# EAGLE board SA (EAGLE 9.6.2)
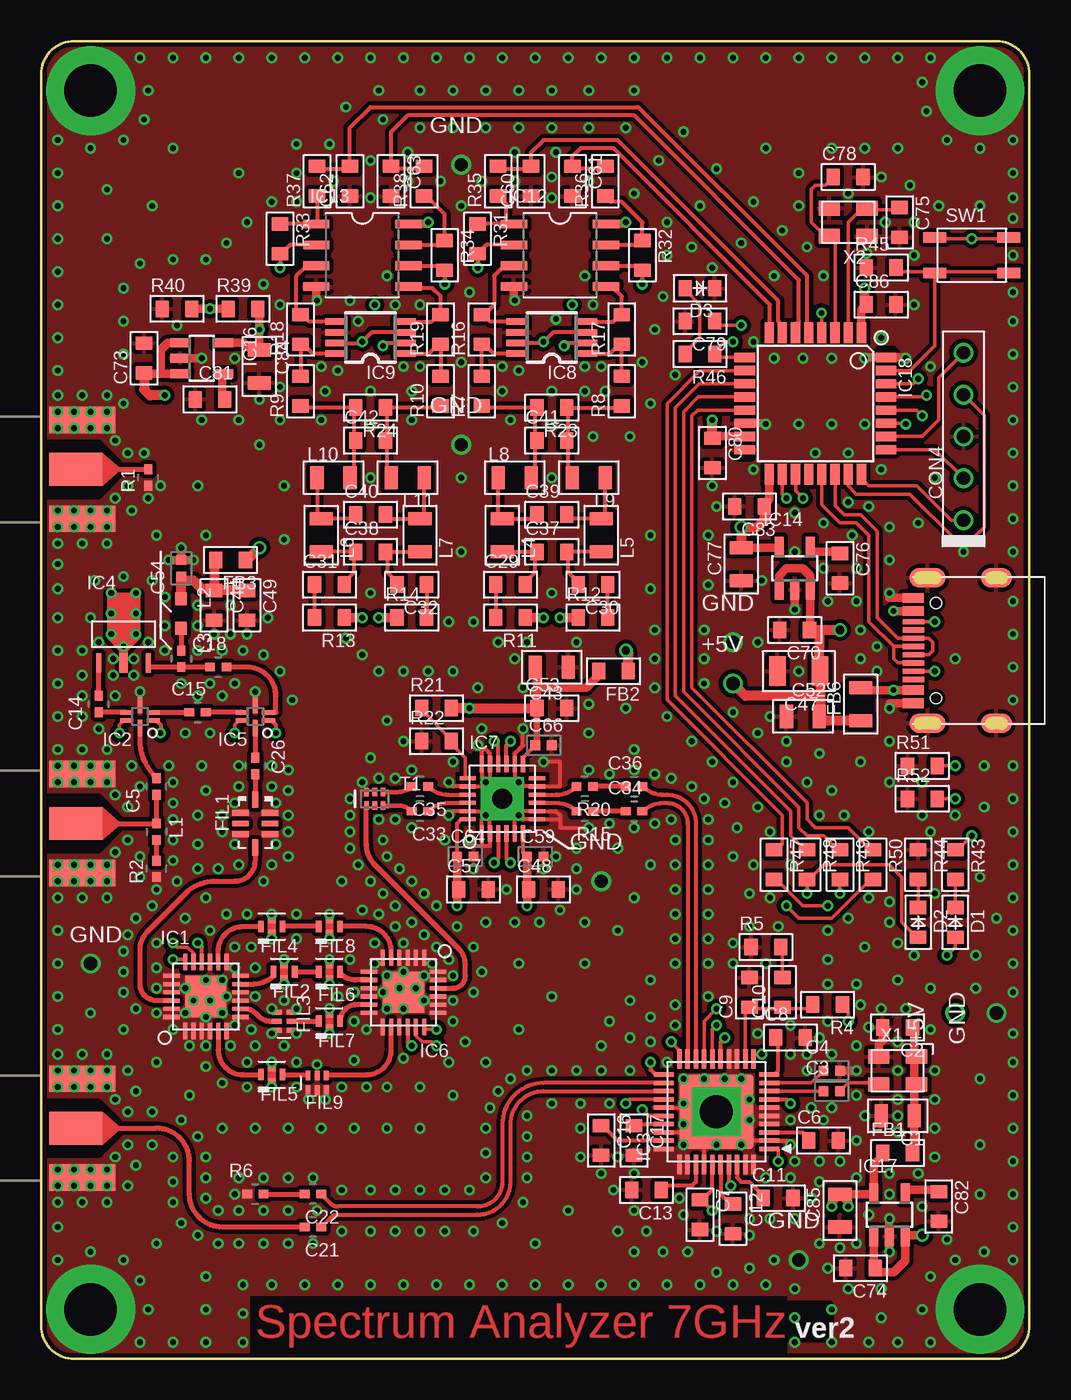
[diagram p2: board, top side]
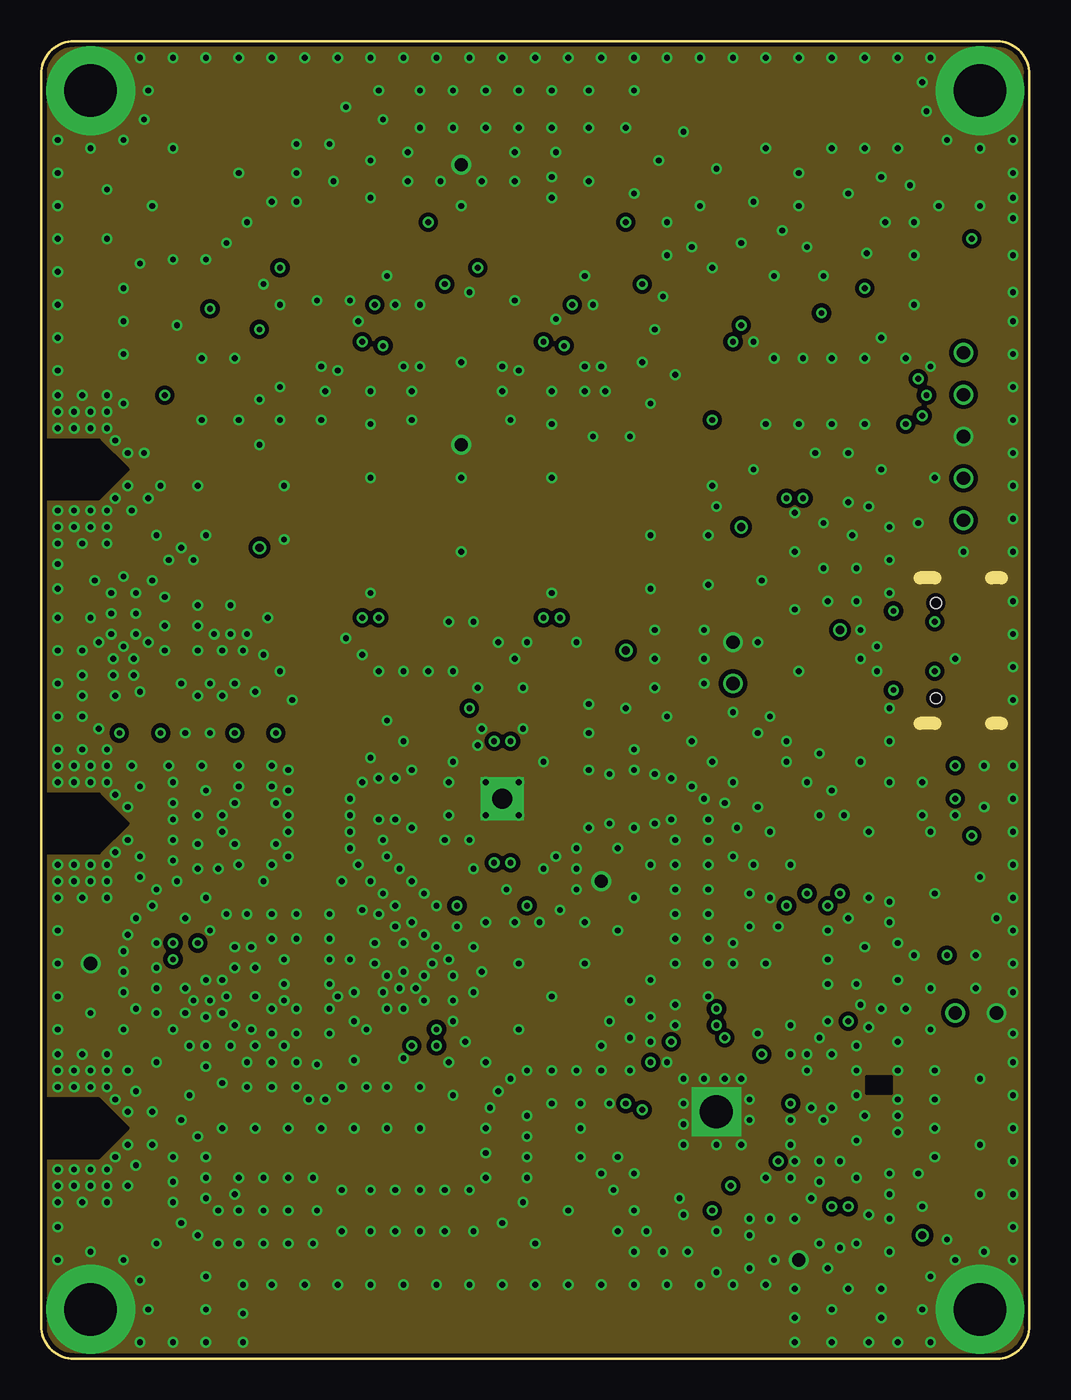
[diagram p3: board, inner layer Route2]
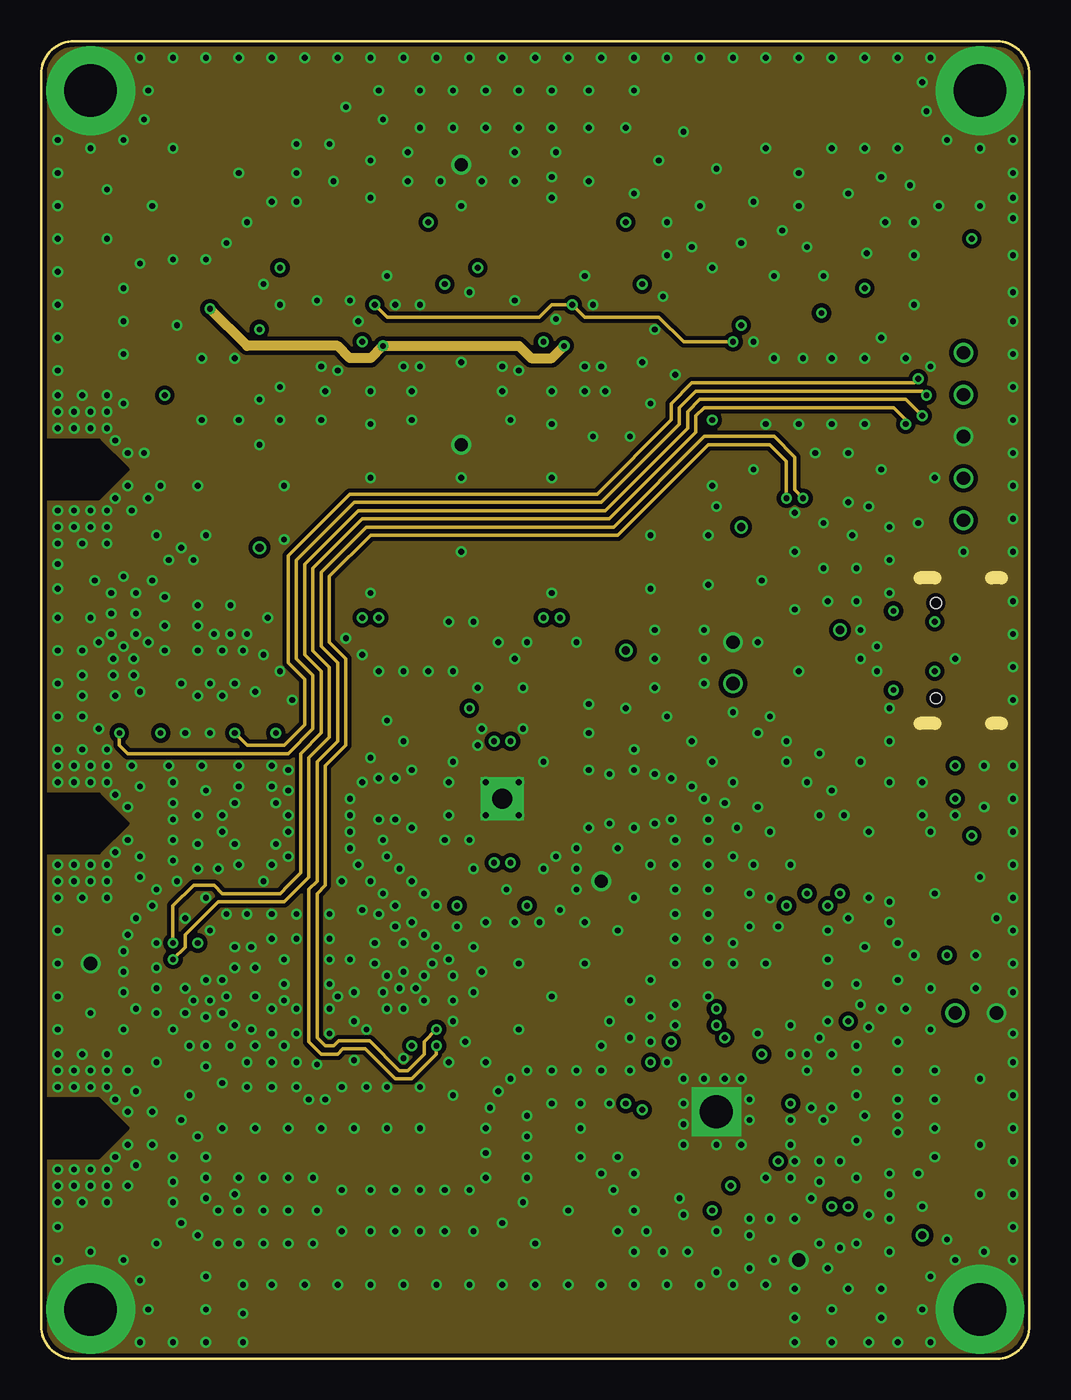
[diagram p4: board, inner layer Route15]
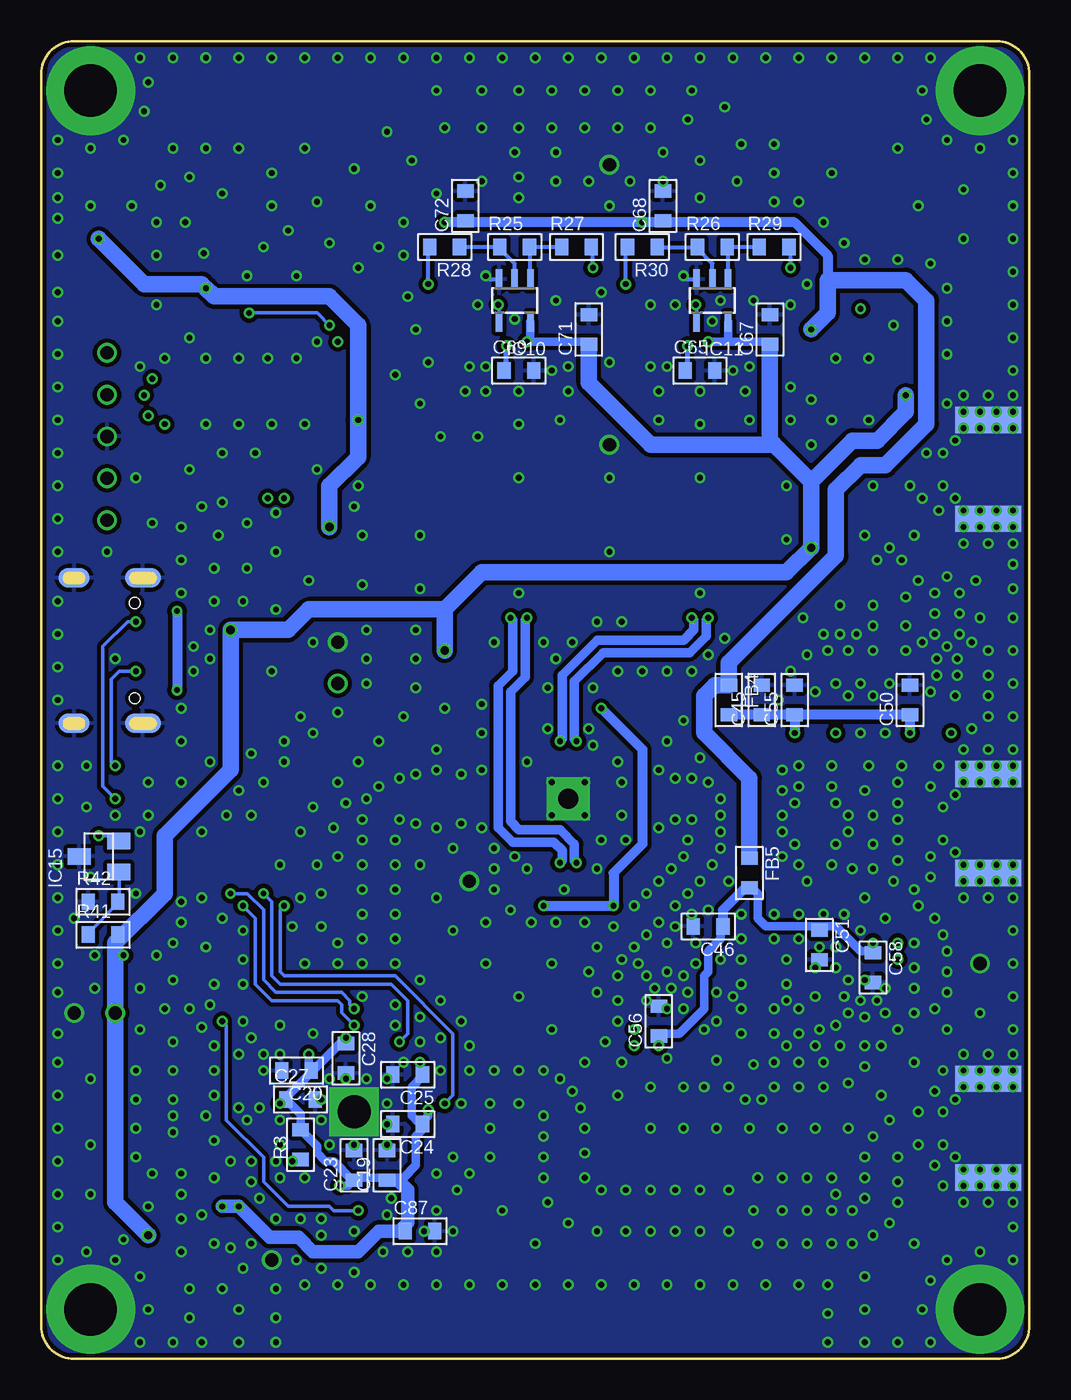
[diagram p5: board, bottom side, seen from below]

Size 60 x 80 mm. Coordinates in mm from the lower left corner, seen from the top.
Outline: 0,78 0,2 arc90 2,0 58,0 arc90 60,2 60,78 arc90 58,80 2,80 arc90 0,78
Copper layers (1*2*15*16): Top 0.035mm / dielectric 0.2mm / Route2 0.0175mm / dielectric 1.065mm / Route15 0.0175mm / dielectric 0.2mm / Bottom 0.035mm
Design rules "JLCPCB_4layer *": minimum track width 6mil, minimum drill 0.3mm, track to track 6mil, track to pad 6mil, pad to pad 6mil, via to via 8mil, smd to smd 0mil, copper to edge 0.2mm, drill to drill 0.4mm, minimum pad ring 8mil, minimum via ring 6mil, stop-mask expansion 2mil, vias tented up to drill 1mm, thermal gap 10mil
tRestrict: 2 lines

## Footprints (pad centres in the part's own frame; a part is rotated, then mirrored left to right if it is on the bottom)
2012 = smd 0.8 x 1.4: 1 -1,0; 2 1,0
1608C = smd 0.8 x 1: 1 -0.9,0; 2 0.9,0
1005 = smd 0.6 x 0.6: 1 -0.5,0; 2 0.5,0
1005RF = smd 0.6 x 0.5: 1 -0.5,0; 2 0.5,0
3216 = smd 1 x 1.8: 1 -1.3,0; 2 1.3,0
SMA-EDGE = smd 1.6 x 4: G1 -3,0; G2 3,0 | smd 1.6 x 4 bottom: G3 -3,0; G4 3,0 | smd 2 x 3.2: SIG 0,0.4
SWD_CON = drill 0.8: 1 -5.08,0; 2 -2.54,0; 3 0,0; 4 2.54,0; 5 5.08,0
5077CR-16-SMC2-BK-TR = smd 0.6 x 1.34: A1,B12:GND -3.2,0.3; A4,B9:VBUS -2.4,0.3; B1,A12:GND 3.2,0.3; B4,A9:VBUS 2.4,0.3 | smd 0.3 x 1.34: A5:CC1 -1.25,0.3; A6:DP1 -0.25,0.3; A7:DN1 0.25,0.3; A8:SBU1 1.25,0.3; B5:CC2 1.75,0.3; B6:DP2 0.75,0.3; B7:DN2 -0.75,0.3; B8:SBU2 -1.75,0.3 | smd 1.2 x 2.2: SHILED1 -4.42,-0.57; SHILED2 4.42,-0.57 | smd 1.2 x 1.9: SHILED3 -4.42,-4.75; SHILED4 4.42,-4.75 | smd 1.2 x 2.2 bottom: SHILED5 -4.42,-0.57; SHILED7 4.42,-0.57 | smd 1.2 x 1.9 bottom: SHILED6 -4.42,-4.75; SHILED8 4.42,-4.75 | hole 0.65: -2.89,-1.07; 2.89,-1.07
D1608 = smd 0.8 x 1: A 0.9,0; K -0.9,0
HOLE_3.2_CON2 = drill 3.2 pad 5.4: T 0,0
1608-FB = smd 0.8 x 1: 1 -0.9,0; 2 0.9,0
2012-R = smd 0.8 x 1.4: 1 -1,0; 2 1,0
RF-FILTER-2012-JOHANSON = smd 0.35 x 1: 1 -0.65,-0.9; 2 0,-0.9; 3 0.65,-0.9; 5 0.65,0.9; 6 0,0.9; 7 -0.65,0.9 | smd 1 x 0.35: 4 1.45,0; 8 -1.45,0
RF-FILTER-1608-TDK = smd 0.35 x 0.7: 1 -0.65,0; 3 0.65,0 | smd 0.45 x 0.4: 2 0,0.4; 4 0,-0.4
RF-FILTER-1608-TDK2 = smd 0.3 x 0.6: 1 -0.55,-0.45; 2 0,-0.45; 3 0.55,-0.45; 4 0.55,0.45; 5 0,0.45; 6 -0.55,0.45
QFN24-QPC6044 = smd 0.25 x 1: 1 -1.25,-2.1; 2 -0.75,-2.1; 3 -0.25,-2.1; 4 0.25,-2.1; 5 0.75,-2.1; 6 1.25,-2.1; 13 1.25,2.1; 14 0.75,2.1; 15 0.25,2.1; 16 -0.25,2.1; 17 -0.75,2.1; 18 -1.25,2.1 | smd 1 x 0.25: 7 2.1,-1.25; 8 2.1,-0.75; 9 2.1,-0.25; 10 2.1,0.25; 11 2.1,0.75; 12 2.1,1.25; 19 -2.1,1.25; 20 -2.1,0.75; 21 -2.1,0.25; 22 -2.1,-0.25; 23 -2.1,-0.75; 24 -2.1,-1.25 | smd 2.5 x 2.5: HT 0,0
SKY13453 = smd 0.8 x 0.28: 1 -0.8,0.25; 2 -0.8,-0.25; 4 0.8,-0.25; 5 0.8,0.25 | smd 0.28 x 1: 3 0,-0.7; 6 0,0.7
QFN40-LMX = smd 0.27 x 1.2: 1 -2.25,-3.2; 2 -1.75,-3.2; 3 -1.25,-3.2; 4 -0.75,-3.2; 5 -0.25,-3.2; 6 0.25,-3.2; 7 0.75,-3.2; 8 1.25,-3.2; 9 1.75,-3.2; 10 2.25,-3.2; 21 2.25,3.2; 22 1.75,3.2; 23 1.25,3.2; 24 0.75,3.2; 25 0.25,3.2; 26 -0.25,3.2; 27 -0.75,3.2; 28 -1.25,3.2; 29 -1.75,3.2; 30 -2.25,3.2 | smd 1.2 x 0.27: 11 3.2,-2.25; 12 3.2,-1.75; 13 3.2,-1.25; 14 3.2,-0.75; 15 3.2,-0.25; 16 3.2,0.25; 17 3.2,0.75; 18 3.2,1.25; 19 3.2,1.75; 20 3.2,2.25; 31 -3.2,2.25; 32 -3.2,1.75; 33 -3.2,1.25; 34 -3.2,0.75; 35 -3.2,0.25; 36 -3.2,-0.25; 37 -3.2,-0.75; 38 -3.2,-1.25; 39 -3.2,-1.75; 40 -3.2,-2.25 | drill 2 pad 3 square: HT 0,0 | smd 4.5 x 4.5: HT2 0,0
SOT89-RF = smd 0.3 x 1.2: 1 -1.5,-1.75; 3 1.5,-1.75 | smd 0.5 x 1.2: 2 0,-1.75
LFCSP24 = smd 0.25 x 1: 1 -1.25,-2.1; 2 -0.75,-2.1; 3 -0.25,-2.1; 4 0.25,-2.1; 5 0.75,-2.1; 6 1.25,-2.1; 13 1.25,2.1; 14 0.75,2.1; 15 0.25,2.1; 16 -0.25,2.1; 17 -0.75,2.1; 18 -1.25,2.1 | smd 1 x 0.25: 7 2.1,-1.25; 8 2.1,-0.75; 9 2.1,-0.25; 10 2.1,0.25; 11 2.1,0.75; 12 2.1,1.25; 19 -2.1,1.25; 20 -2.1,0.75; 21 -2.1,0.25; 22 -2.1,-0.25; 23 -2.1,-0.75; 24 -2.1,-1.25 | drill 1.2 pad 2.6 square: HT 0,0
MSOP8 = smd 0.4 x 1.3: 1 -0.975,-2.1; 2 -0.325,-2.1; 3 0.325,-2.1; 4 0.975,-2.1; 5 0.975,2.1; 6 0.325,2.1; 7 -0.325,2.1; 8 -0.975,2.1
SOT23-5-2 = smd 0.4 x 1.2: 1 -0.95,-1.3; 2 0,-1.3; 3 0.95,-1.3; 4 0.95,1.3; 5 -0.95,1.3
SOP8-3 = smd 0.52 x 1.6: 1 -1.905,-2.8; 2 -0.635,-2.8; 3 0.635,-2.8; 4 1.905,-2.8; 5 1.905,2.8; 6 0.635,2.8; 7 -0.635,2.8; 8 -1.905,2.8
SOT23-5 = smd 0.55 x 1.2: 1 -0.95,-1.3; 2 0,-1.3; 3 0.95,-1.3; 4 0.95,1.3; 5 -0.95,1.3
SC59 = smd 1 x 1.4: 1 -0.95,-1.2; 2 0.95,-1.2; 3 0,1.2
TQFP32-08 = smd 1.27 x 0.559: 1 -4.293,2.8; 2 -4.293,2; 3 -4.293,1.2; 4 -4.293,0.4; 5 -4.293,-0.4; 6 -4.293,-1.2; 7 -4.293,-2; 8 -4.293,-2.8; 17 4.293,-2.8; 18 4.293,-2; 19 4.293,-1.2; 20 4.293,-0.4; 21 4.293,0.4; 22 4.293,1.2; 23 4.293,2; 24 4.293,2.8 | smd 0.559 x 1.27: 9 -2.8,-4.293; 10 -2,-4.293; 11 -1.2,-4.293; 12 -0.4,-4.293; 13 0.4,-4.293; 14 1.2,-4.293; 15 2,-4.293; 16 2.8,-4.293; 25 2.8,4.293; 26 2,4.293; 27 1.2,4.293; 28 0.4,4.293; 29 -0.4,4.293; 30 -1.2,4.293; 31 -2,4.293; 32 -2.8,4.293
1608-L = smd 0.8 x 0.7: 1 -0.9,0; 2 0.9,0
1608 = smd 0.8 x 1: 1 -0.9,0; 2 0.9,0
1608-3 = smd 0.8 x 1: 1 -0.9,0; 2 0.9,0
SKRPACE010 = smd 1.4 x 0.65: 1 -2.24,1.075; 2 2.25,1.075; 3 -2.25,-1.075; 4 2.25,-1.075
X4B40L1 = smd 0.28 x 0.5: 1 -0.5,-0.41; 2 0,-0.41; 3 0.5,-0.41; 4 0.5,0.41; 5 0,0.41; 6 -0.5,0.41
TESTPIN = drill 0.8: 1 0,0
KC3225 = smd 1.3 x 0.9: 1 -1.15,-0.85; 2 1.15,-0.85; 3 1.15,0.85; 4 -1.15,0.85
KC3225-CRYSTAL = smd 1.3 x 0.9: 1 -1.15,-0.85; 2 1.15,-0.85; 3 1.15,0.85; 4 -1.15,0.85

## Placement (x,y rotation side)
C1  10u  [2012]  52,14.75 180 top
C2  0.1u  [1608C]  52,20.12 180 top
C3  1n  [1005]  48,16.25 0 top
C4  1n  [1005]  48,17.5 0 top
C5  22p  [1005RF]  7,34.75 90 top
C6  0.47u  [1608C]  47.5,13.25 0 top
C7  1.5n  [1608C]  40,8.75 270 top
C8  1u  [1608C]  45.5,19.5 0 top
C9  560p  [1608C]  43,22.25 90 top
C10  120n  [1608C]  45,22.25 90 top
C11  10n  [1608C]  44.75,9.75 0 top
C12  10u  [1608C]  42,8.5 270 top
C13  10u  [1608C]  36.75,10.25 180 top
C14  100p  [1005RF]  3.5,39.75 90 top
C15  100p  [1005RF]  9.5,39.25 0 top
C16  10u  [1608C]  34,13.25 270 top
C17  0.1u  [1608C]  36,13.25 270 top
C18  100p  [1005RF]  10.75,42 0 top
C19  1u  [1608C]  39,11.75 90 bottom
C20  0.1u  [1608C]  44.5,17.5 180 bottom
C21  100p  [1005RF]  16.5,8 180 top
C22  100p  [1005RF]  16.5,10 180 top
C23  0.1u  [1608C]  41,11.75 90 bottom
C24  0.1u  [1608C]  37.75,14.25 180 bottom
C25  0.1u  [1608C]  37.75,17.25 180 bottom
C26  100p  [1005RF]  13,36 270 top
C27  0.1u  [1608C]  44.25,15.75 0 bottom
C28  0.1u  [1608C]  41.5,18.25 270 bottom
C29  10u  [1608C]  28.5,47 0 top
C30  10u  [1608C]  33.5,47 180 top
C31  10u  [1608C]  17.5,47 0 top
C32  10u  [1608C]  22.5,47 180 top
C33  100p  [1005RF]  23,33.25 180 top
C34  100p  [1005RF]  36,33.25 0 top
C35  100p  [1005RF]  23,34.75 180 top
C36  100p  [1005RF]  36,34.75 0 top
C37  1000p  [1608C]  31,49 0 top
C38  1000p  [1608C]  20,49 0 top
C39  3300p  [1608C]  31,51.25 0 top
C40  3300p  [1608C]  20,51.25 0 top
C41  1000p  [1608C]  31,55.75 0 top
C42  1000p  [1608C]  20,55.75 0 top
C43  10u  [2012]  31,42 0 top
C44  1u  [1608C]  10.5,45.75 270 top
C45  1u  [1608C]  16.25,40 90 bottom
C46  1u  [1608C]  19.5,26.25 180 bottom
C47  10u  [3216]  46,41.75 180 top
C48  0.1u  [1608C]  30.5,28.5 0 top
C49  10n  [1608C]  12.5,45.75 270 top
C50  0.01u  [1608C]  7.25,40 90 bottom
C51  1u  [1608C]  12.75,25.12 270 bottom
C52  10u  [2012]  46.25,39 180 top
C53  0.1u  [1608C]  31,39.5 0 top
C54  100p  [1005]  8.5,48 90 top
C55  0.01u  [1608C]  14.25,40 90 bottom
C56  0.01u  [1608C]  22.5,20.5 90 bottom
C57  0.1u  [1608C]  26.25,28.5 0 top
C58  0.01u  [1608C]  9.5,23.75 270 bottom
C59  1n  [1005]  30,30.5 0 top
C60  22p  [1608C]  29.75,71.5 90 top
C61  22p  [1608C]  32.25,71.5 270 top
C62  22p  [1608C]  18.75,71.5 90 top
C63  22p  [1608C]  21.25,71.5 270 top
C64  1n  [1005]  25.75,30.5 0 top
C65  0.1u  [1608C]  20,60 0 bottom
C66  1n  [1005]  30.5,37.25 0 top
C67  0.1u  [1608C]  15.75,62.5 90 bottom
C68  0.1u  [1608C]  22.25,70 90 bottom
C69  0.1u  [1608C]  31,60 0 bottom
C70  1u  [1608C]  45.75,44.25 180 top
C71  0.1u  [1608C]  26.75,62.5 90 bottom
C72  0.1u  [1608C]  34.25,70 90 bottom
C73  1u  [1608C]  6.25,60.75 90 top
C74  1u  [1608C]  49.75,5.5 180 top
C75  10p  [1608C]  52.12,69 270 top
C76  0.1u  [1608C]  48.5,48 270 top
C77  10u  [2012]  42.5,48.25 270 top
C78  10p  [1608C]  49,71.75 0 top
C79  0.1u  [1608C]  40,63 180 top
C80  0.1u  [1608C]  40.75,55 270 top
C81  0.1u  [1608C]  10.25,58.25 180 top
C82  0.1u  [1608C]  54.5,9.25 270 top
C83  0.1u  [1608C]  43,51.75 180 top
C84  10u  [2012]  13.25,60.25 270 top
C85  10u  [2012]  48.5,9 270 top
C86  0.1u  [1608C]  51,64 0 top
C87  1u  [1608C]  37,7.75 0 bottom
CON1  DM_L  [SMA-EDGE]  2.5,54 90 top
CON2  RF_IN  [SMA-EDGE]  2.5,32.5 90 top
CON3  PLL_OUT  [SMA-EDGE]  2.5,14 90 top
CON4  SWD_CON  [SWD_CON]  56,56 90 top
CON5  USB-C  [5077CR-16-SMC2-BK-TR]  53.25,43 90 top
D1  PWR  [D1608]  55.5,26.5 270 top
D2  LOCK  [D1608]  53.25,26.5 270 top
D3  LED  [D1608]  40,65 180 top
DR1  HOLE-3.2C  [HOLE_3.2_CON2]  3,3 0 top
DR2  HOLE-3.2C  [HOLE_3.2_CON2]  57,3 0 top
DR3  HOLE-3.2C  [HOLE_3.2_CON2]  3,77 0 top
DR4  HOLE-3.2C  [HOLE_3.2_CON2]  57,77 0 top
FB1  FB  [1608-FB]  52,12.5 0 top
FB2  FB  [1608-FB]  34.75,41.75 180 top
FB3  FB  [1608-FB]  11.5,48.5 180 top
FB4  FB  [1608-FB]  18.25,40 270 bottom
FB5  FB  [1608-FB]  17,29.5 270 bottom
FB6  FB  [2012-R]  49.75,39.75 270 top
FIL1  5515LP15A0730001E  [RF-FILTER-2012-JOHANSON]  13,32.5 270 top
FIL2  DEA165150HT-8025C2  [RF-FILTER-1608-TDK]  14.75,23.5 0 top
FIL3  DEA163500LT-5106C1  [RF-FILTER-1608-TDK2]  14.75,20.5 90 top
FIL4  DEA162025LT-5046C1  [RF-FILTER-1608-TDK]  14,26.25 0 top
FIL5  DEA160960LT-5059A1  [RF-FILTER-1608-TDK]  14,17.25 0 top
FIL6  DEA165150HT-8025C2  [RF-FILTER-1608-TDK]  17.5,23.5 0 top
FIL7  DEA162400HT-8053A1  [RF-FILTER-1608-TDK]  17.5,20.5 0 top
FIL8  DEA162025LT-5046C1  [RF-FILTER-1608-TDK]  17.5,26.25 0 top
FIL9  DEA160787LT-5032A1  [RF-FILTER-1608-TDK2]  16.75,16.75 0 top
IC1  QPC6044  [QFN24-QPC6044]  10,22 0 top
IC2  SKY13453  [SKY13453]  6,39 180 top
IC3  LMX2572  [QFN40-LMX]  41,15 90 top
IC4  SKY65017  [SOT89-RF]  5,44 0 top
IC5  SKY13453  [SKY13453]  13,39 180 top
IC6  QPC6044  [QFN24-QPC6044]  22,22.25 180 top
IC7  ADL5380  [LFCSP24]  28,34 0 top
IC8  MCP6D11  [MSOP8]  31,62 90 top
IC9  MCP6D11  [MSOP8]  20,62 90 top
IC10  SN74LVC1G66  [SOT23-5-2]  31.25,64.25 180 bottom
IC11  SN74LVC1G66  [SOT23-5-2]  19.25,64.25 180 bottom
IC12  TLV3542  [SOP8-3]  31.5,67 270 top
IC13  TLV3542  [SOP8-3]  19.5,67 270 top
IC14  TAR5SB33  [SOT23-5]  45.75,48 0 top
IC15  TLV431  [SC59]  56.5,30.5 90 bottom
IC16  TAR5SB33  [SOT23-5]  9.75,60.75 270 top
IC17  TAR5SB33  [SOT23-5]  51.5,8.75 0 top
IC18  STM32G431K  [TQFP32-08]  47,58 270 top
L1  47nH  [1005RF]  7,32 270 top
L2  100nH  [1608-L]  8.5,45.25 270 top
L3  33nH  [1005RF]  8.5,42.5 270 top
L4  10uH  [2012-R]  28,50 90 top
L5  10uH  [2012-R]  34,50 90 top
L6  10uH  [2012-R]  17,50 90 top
L7  10uH  [2012-R]  23,50 90 top
L8  10uH  [2012-R]  28.75,53.5 0 top
L9  10uH  [2012-R]  33.25,53.5 180 top
L10  10uH  [2012-R]  17.75,53.5 0 top
L11  10uH  [2012-R]  22.25,53.5 180 top
R1  50  [1005RF]  6.5,53.5 90 top
R2  50  [1005RF]  7,29.75 90 top
R3  1k  [1608]  44.25,13 90 bottom
R4  120  [1608]  47.75,21.5 180 top
R5  330  [1608]  44,25 0 top
R6  50  [1005RF]  13,10 0 top
R7  360  [1608]  26.75,58.75 90 top
R8  360  [1608]  35.25,58.75 90 top
R9  360  [1608]  15.75,58.75 90 top
R10  360  [1608]  24.25,58.75 90 top
R11  25  [1608]  28.5,45 180 top
R12  25  [1608]  33.5,45 0 top
R13  25  [1608]  17.5,45 180 top
R14  25  [1608]  22.5,45 0 top
R15  25  [1005RF]  33,33.25 180 top
R16  10k  [1608]  26.75,62.5 90 top
R17  10k  [1608-3]  35.25,62.5 90 top
R18  10k  [1608]  15.75,62.5 90 top
R19  10k  [1608-3]  24.25,62.5 90 top
R20  25  [1005RF]  33,34.75 180 top
R21  DNP  [1608]  24,39.5 0 top
R22  DNP  [1608]  24,37.5 0 top
R23  120  [1608]  31,57.75 180 top
R24  120  [1608]  20,57.75 180 top
R25  1k  [1608]  31.25,67.5 0 bottom
R26  1k  [1608]  19.25,67.5 0 bottom
R27  47  [1608-3]  27.5,67.5 0 bottom
R28  47  [1608-3]  35.5,67.5 180 bottom
R29  47  [1608-3]  15.5,67.5 0 bottom
R30  47  [1608-3]  23.5,67.5 180 bottom
R31  1k  [1608-3]  26.5,68 270 top
R32  1k  [1608-3]  36.5,67 270 top
R33  1k  [1608-3]  14.5,68 270 top
R34  1k  [1608-3]  24.5,67 270 top
R35  39  [1608]  27.75,71.5 90 top
R36  39  [1608]  34.25,71.5 90 top
R37  39  [1608]  16.75,71.5 90 top
R38  39  [1608]  23.25,71.5 90 top
R39  5.1k  [1608]  12.25,63.75 0 top
R40  5.1k  [1608]  8.25,63.75 0 top
R41  10k  [1608]  56.25,25.75 0 bottom
R42  3.6k  [1608]  56.25,27.75 0 bottom
R43  1k  [1608]  55.5,30 270 top
R44  1k  [1608]  53.25,30 270 top
R45  10k  [1608]  51,66.25 0 top
R46  1k  [1608]  40,61 180 top
R47  39  [1608]  44.5,30 270 top
R48  39  [1608]  46.5,30 270 top
R49  39  [1608]  48.5,30 270 top
R50  39  [1608]  50.5,30 270 top
R51  5.1k  [1608]  53.5,36 0 top
R52  5.1k  [1608]  53.5,34 0 top
SW1  BOOT0  [SKRPACE010]  56.5,67 0 top
T1  X4B40L1  [X4B40L1]  20.25,34 0 top
TP1  +5V  [TESTPIN]  42,41 0 top
TP2  GND  [TESTPIN]  42,43.5 0 top
TP3  GND  [TESTPIN]  58,21 90 top
TP4  +5V  [TESTPIN]  55.5,21 90 top
TP5  GND  [TESTPIN]  34,29 0 top
TP6  GND  [TESTPIN]  25.5,72.5 0 top
TP7  GND  [TESTPIN]  25.5,55.5 0 top
TP8  GND  [TESTPIN]  46,6 0 top
TP9  GND  [TESTPIN]  3,24 0 top
X1  48MHz  [KC3225]  52,17.5 180 top
X2  12MHz  [KC3225-CRYSTAL]  49,69 0 top

## Tracks (layer width: path | path; a pad name or v marks a point on that pad's centre or on a via)
+3V3  (via drill 0.35)
  Top 0.508: IC12.8 35.41,68.91 v35.5,69 | IC13.8 23.41,68.91 v23.5,69 | R39.2 13.25,63.65 v13.25,62.5 C84.1 12.75,61.25 12.3,61.7 IC16.5
  Bottom 0.61: 22.5,69 14.25,69 12.25,67 12.25,65.5 | 22.5,69 v23.5,69 34.25,69 | 34.25,69 v35.5,69 | C72.1 34.25,69 | C68.1 22.35,69 22.5,69 | FB5.1 17,30.75
  Bottom 1.016: 17,30.75 17,35.25 19.75,38 19.75,40.25 19.1,40.9 FB4.1 18.25,42.25 11.75,48.75 11.75,52.75 10.25,54.25 8.75,54.25 6.25,56.75 6.25,64.25 7.5,65.5 12.25,65.5 12.25,65 12.25,63.5 v13.25,62.5
+3V3D  (via drill 0.35, 0.5)
  Top 0.203: SW1.1 54.34,68 v56.5,68 58.67,68 SW1.2
  Top 0.508: IC18.15 40.85,56 C80.1 | IC18.17 44.2,52.2 43.9,51.9 C83.1 | IC18.1 49.8,63.7 C86.1 | IC14.5 44.75,49.25 C77.1
  Top 0.61: C80.1 v40.75,57 | C86.1 50,64.1 v50,65 | C77.1 v42.5,50.5 43.5,50.5 43.9,50.9 C83.1
  Bottom 1.016: v42.5,50.5 42.5,53 40.75,54.75 v40.75,57 40.75,62.75 42.5,64.5 49.5,64.5 v50,65 50.25,65.25 53.75,65.25 v56.5,68
+5V  (via drill 0.35, 0.5)
  Top 0.203: D1.A 55.5,25 v55,24.5
  Top 0.254: IC9.3 20.07,62.33 v19.5,61.75 19.43,61.67 IC9.7 | IC8.3 31.07,62.33 v30.5,61.75 30.5,61.67 IC8.7
  Top 0.508: IC14.1 44.8,47.55 45.25,48 46.25,48 46.7,47.55 IC14.3 46.7,44.3 C70.1 | IC16.3 7.25,59.8 | 7.25,59.8 6.3,59.8 C73.1 | IC16.1 7.7,61.7 7.25,61.25 7.25,59.8 | v53.5,7.5 52.5,7.5 IC17.3 52.45,5.95 51.75,5.25 50.9,5.25 C74.1 50.55,5.6 IC17.1
  Top 0.61: 47.3,40.25 C47.1 47.25,41.8 47.25,43 47.25,44.25 C70.1 v48.5,44.25 | 47.3,40.25 47.3,39 C52.1 47.5,38.75 FB6.2 | v13.25,49.25 12.5,48.5 FB3.1 | C73.1 6.25,58.85 6.6,58.5 v7.5,58.5 | TP1.1 42.75,40.25 47.3,40.25 | FB2.1 35.65,42.75 35.65,42.85 v35.5,43
  Bottom 0.203: R41.2 D1.A 55.5,25.25
  Bottom 0.508: IC10.5 30.3,61.75 v30.5,61.75 26.9,61.75 C71.1 26.75,61.25 | v19.5,61.75 18.25,61.75 | 18.25,61.75 15.9,61.75 C67.1 15.75,61.25 | IC11.5 18.3,61.8 18.25,61.75
  Bottom 0.61: v55,24.5 55.5,24.5
  Bottom 1.016: v35.5,43 35.5,45.5 | 35.5,45.5 33.25,47.75 14.75,47.75 v13.25,49.25 13.25,53.25 | 13.25,53.25 10.75,55.75 9.25,55.75 7.5,57.5 v7.5,58.5 | 35.5,45.5 43.75,45.5 45,44.25 v48.5,44.25 48.5,35.75 52.5,31.75 52.5,28.25 55.5,25.25 55.5,24.5 TP4.1 55.5,9.5 v53.5,7.5 | 13.25,53.25 15.25,55.25 15.5,55.5 | 15.5,55.5 15.75,55.75 15.75,61.25 | 15.5,55.5 23,55.5 26.75,59.25 26.75,61.25
ADC_IN
  Top 0.254: R35.2 27.9,72.25 29.6,72.25 C60.2 29.75,73.25 30.5,74 35,74 44.75,64.25 44.75,63 45,62.75 IC18.7
ADC_IP
  Top 0.254: R36.2 34.1,72.25 32.4,72.25 C61.1 32.25,73 32.75,73.5 34.75,73.5 44.25,64 44.25,62.34 IC18.8
ADC_QN
  Top 0.254: R37.2 16.9,72.25 18.6,72.25 C62.2 18.75,74.75 20,76 36.25,76 46.5,65.75 46.5,62.39 IC18.5
ADC_QP
  Top 0.254: R38.2 23.1,72.25 21.4,72.25 C63.1 21.25,74.5 22.25,75.5 36,75.5 46,65.5 46,63 45.8,62.8 IC18.6
AMP_IN
  Top 0.254: 32,53.75 L9.2 32,53.75 | R8.1 35.15,57.75 R23.1 32,57.65 32,55.85 C41.2 32,55.65 32,53.75
AMP_IP
  Top 0.254: 30,53.75 L8.2 30,53.75 | R7.1 26.85,57.75 R23.2 30,57.65 30,55.85 C41.1 30,55.65 30,53.75
AMP_QN
  Top 0.254: L11.2 21,53.75 21,55.65 C42.2 21,55.85 21,57.65 R24.1 24.15,57.75 R10.1
AMP_QP
  Top 0.254: L10.2 19,53.75 19,55.65 C42.1 19,55.85 19,57.65 R24.2 15.85,57.75 R9.1
DUMMY_LOAD
  Top 0.305: CON1.SIG R1.2
FIL_SW1  (via drill 0.35)
  Top 0.203: IC18.28 53.15,57.6 v53.5,57.25 | IC1.17 9.25,24.62 8.88,25 8.25,25 v8,25.25
  Route15 0.203: v53.5,57.25 52.5,58.25 40,58.25 39.25,57.5 39.25,56.5 34.25,51.5 19.25,51.5 16,48.25 16,42.75 17,41.75 17,38 15.75,36.75 15.75,29.5 15,28.75 14.5,28.25 11,28.25 10.5,28.75 9.25,28.75 8,27.5 v8,25.25
FIL_SW2  (via drill 0.35)
  Top 0.203: IC18.27 52.45,56.8 v52.5,56.75 | IC1.18 8.75,24.25 v8,24.25
  Route15 0.203: v52.5,56.75 52.5,57 51.75,57.75 40.25,57.75 39.75,57.25 39.75,56.25 34.5,51 19.5,51 16.5,48 16.5,43 17.5,42 17.5,37.75 16.25,36.5 16.25,29.25 14.75,27.75 10.75,27.75 8.75,25.75 8.75,25 v8,24.25
FIL_SW3  (via drill 0.35)
  Top 0.203: v46.25,52.25 45.8,52.7 IC18.19 | IC6.17 22.75,19.62 23.12,19.25 23.75,19.25 v24,19
  Route15 0.203: v46.25,52.25 45.75,52.75 45.75,54.75 44.5,56 40.25,56 34.75,50.5 19.75,50.5 17,47.75 17,43.25 18,42.25 18,37.5 16.75,36.25 16.75,29 16.25,28.5 16.25,19.25 17,18.5 18,18.5 18.31,18.81 19.69,18.81 21.5,17 22.5,17 24,18.5 v24,19
FIL_SW4  (via drill 0.35)
  Top 0.203: v45.25,52.25 45,52.5 IC18.18 | IC6.18 23.25,20 v24,20
  Route15 0.203: v45.25,52.25 45.25,54.5 44.25,55.5 40.5,55.5 35,50 20,50 17.5,47.5 17.5,43.5 18.5,42.5 18.5,37.25 17.25,36 17.25,28.75 16.75,28.25 16.75,19.5 17.25,19 17.75,19 18.06,19.31 19.94,19.31 21.75,17.5 22.25,17.5 23.25,18.5 23.25,19.25 v24,20
FILTER_IN
  Top 0.305: C26.2 FIL1.8
FILTER_OUT
  Top 0.305: T1.1 19.75,31.25 arc45 20.28,29.97 25.36,24.89 arc-45 25.75,23.95 25.75,23.25 arc-90 25,22.5 IC6.22
GND  (via drill 0.35)
  Top 0.254: v24.75,35 25,34.75 IC7.20 26.75,34.75 v27,35 | 26.75,37 26.75,36.75 IC7.18 26.75,35.25 v27,35 | 26.75,37 v26.5,37.25 | 26.75,37 27,37 27.25,36.75 IC7.17 27.25,35.25 v27,35 | v29.25,38.25 29.25,37.25 28.75,36.75 IC7.14 28.75,35.25 v29,35 29.25,34.75 IC7.11 31.5,34.75 31.5,36.25 v30.5,36.25 | v24.75,33 25,33.25 IC7.23 26.75,33.25 v27,33 | 26.75,31.12 27.25,31.12 IC7.2 27.25,32.75 v27,33 | 26.75,31.12 25.75,31.12 25.75,31.25 v26,31.5 | 26.75,31.12 26.75,31.25 IC7.1 26.75,32.75 v27,33 | 31.5,32.75 31.5,33 31.25,33.25 IC7.8 29.25,33.25 v29,33 | 31.5,32.75 31.5,32.25 v33.25,32.25 | 31.5,32.75 IC7.7 29.25,32.75 v29,33 | IC7.5 28.75,32.75 v29,33 | IC3.25 39,15.25 v39,15.5 | IC3.28 39,13.75 39,13.8 v39,14.25 | IC3.34 40.25,13 v41,13 | v45.5,13 45.25,13.25 IC3.2 42.75,13.25 v42.5,13
  Top 0.508: IC14.2 v45.75,45.5 | IC16.2 v9.75,60.75 | v51.5,6.5 IC17.2 v51.5,8.5 | v16.75,64.25 16.7,64.3 IC13.4 | v28.75,64.25 28.7,64.3 IC12.4 | v52.5,60.75 52.45,60.8 IC18.32 50.05,60.8 v50,60.75 | IC18.14 43.95,56.8 v44,56.75 | C54.2 v7.75,48.5 | C54.2 v8.5,49.25 | C54.2 v9.25,48.5 | CON5.A1,B12:GND 51.55,39.8 51.5,39.75 v51.5,39.5 | CON5.B1,A12:GND 51.5,46.2 v51.5,46.5 | C4.2 v49.5,17.5 | C2.2 51.1,19.35 50.85,19.1 X1.2
  Bottom 0.254: v21,65.75 20.8,65.55 IC11.3 | v33,65.75 32.8,65.55 IC10.3
  other vias: 43.75,47.25 47.75,46 44.5,65.75 40,70 31,74.75 26.75,38.25 24,27.5 21.5,27.5 21,30.5 18.75,31 49.25,50 45.75,51.38 45.75,49 51.5,50.5 55.5,42.5 59,46 59,44 59,42 51.5,37.5 55.5,33 45.25,37.5 40.25,41 51.5,48.5 37.25,44.25 39.5,37.5 44.25,32 51,54 43.25,54 51,62 43.25,61.75 50,56.75 47.5,65.75 45,68.5 41,72.25 35.5,74.75 36,77 31,77 27,74.75 27,77 23,77 23,74.75 18.5,76 20,72.75 25.5,70 40.75,66.25 38,69 15.5,70.25 31,71.75 31,70.5 20,70.5 5,63 12,57 5.75,44 5.75,45.25 4.25,45.25 4.25,44 3.25,47.25 5,47.5 6.75,47.25 8,30.25 1,35 3,35 4,35 4,37 2.5,37 1,37 1,30 2,30 4,30 4,28 2.5,28 1,28 1,16.5 2,16.5 4,16.5 4,18.5 2.5,18.5 1,18.5 1,11.5 3,11.5 4,11.5 4,9.5 2.5,9.5 1,9.5 6,40.5 9.5,43 11.5,45.75 11.75,33.75 11.75,31.25 14,30 14,34.75 12,7 11.75,10 15,9 16.75,9 5.25,15 5.25,13 8,9.5 10,11 5.25,33.5 5.25,31.5 13,40.5 8.5,41 11,43 10.25,38 7.75,36 14,36 5.25,25.75 40.5,32.75 40.5,25.5 15,7 15,11 18.25,10.25 18.25,7.75 29.5,43.5 32.5,43.5 33.25,35.75 53,64 37.25,62.5 29,60 18,60 22,60.25 33,60.25 14,27 17.5,27 25,20.5 24.75,18 23,16.5 52,25.25 43,28.25 40.5,27 40.75,36.25 34.5,35.5 34.5,32.5 20,10.25 20,7.75 6,30.5 9.5,29.75 12,34.75 20.5,27 18.75,33 18.75,34 19.5,35 21.5,35.25 22,37.5 41.5,33.75 40.5,30 43.25,30 20.5,32.75 33.25,38 39.5,34.75 38.25,32.75 25.25,26.25 50.25,51.75 56,49 47.25,36.75 51.5,35 24.75,44.75 25.5,49 25.5,53.5 22,41.75 25,41.75 37,46.75 37,50 40.5,50 40.5,47 33.5,56 17,57 15.5,72 13.5,65.25 8.25,62.75 4,68 6.75,70 5,61 6.5,52.25 3,45 2.5,41.5 1,24 1,26 16,4.5 14,4.5 12.25,4.5 10,5 7,7 57,10 57,13 57,17 56.75,22.5 57.25,33.5 57,29.25 57.25,36 57,70 51,71.75 44,73.5 48,73.5 52,73.5 43.25,70.25 42.5,67.75 4.5,40.25 2.5,43 2.5,39 10,50 7,50 13.25,55.5 20,46.5 31,46.5 20,53.5 31,53.5 25.5,60.5 36.5,60.5 14.5,59 6.75,13 12,30 12,36 8,33.75 6.75,27.5 11.5,44 7,28.5 5.5,36 5.25,10.5 5.25,17.5 12.5,27 15.25,40 49,70.75 54.5,70 57,73.5 53,67 44.5,60.75 46.25,60.75 48,60.75 46,56.75 48,56.75 49,55 47,55 54.25,53.5 50.12,67.12 3,6.5 6.5,3 53.5,3 59,6 3,73.5 6.5,77 53.5,77.5 1,48.25 24,25 43.5,33.5 46,41.75 40.25,44.25 37.25,40.75 38,39 44.25,39 43.5,43.5 51.5,27.75 47.25,33 40.75,53 37,58 36,70.75 39.5,67.5 40.25,34 12.25,2.75 12,72 23,10.25 23,7.75 5,24.75 22.5,29 28.75,26.5 30.25,26.5 33,26.5 32.5,28.5 35,31 36,28 38.5,25.5 38.5,27 37,30 36,37 26.25,25 23,64 33.5,64 20.75,75.25 20.5,77 31.25,73.25 4,71 54,79 25,74.75 25,77 29,77 29,74.75 33.25,74.75 33.25,77 23.5,41.75 22.5,57 28.5,57 26,64.75 37.75,64.5 14.5,64 14,70.25 37.5,72.75 38,67 21.5,64 19.25,63 31.25,63.12 9.75,57 5,65 8,66.75 10,66.75 6,66.5 8,73.5 11.75,60.75 1,56.5 3,56.5 4,56.5 4,58.5 2.5,58.5 1,58.5 1,51.5 3,51.5 4,51.5 4,49.5 2.5,49.5 1,49.5 5.25,53 7.25,53 5.25,55 13.5,29 11.25,27 8.25,29 10.75,29.75 19.5,27.25 22,25.25 8.5,14.5 9.5,7.5 20,29 18.25,29 32.5,29.75 28.25,28.5 27,26.5 31.5,27.25 26.5,40.75 28.75,42.5 21,38.75 13.5,42.75 51,2.5 10,3 35.5,39.5 13.75,45 14.75,49.75 20.5,41.75 13.5,9 13.5,7 10.75,9 14,25.5 17.5,25.5 14.75,24.25 14.75,22.75 17.5,24.25 17.5,22.75 17.5,21.25 17.5,19.75 14,18 14,16.5 16.75,17.88 16.25,15.75 17.25,15.75 14,19.75 15.5,19.75 15.5,21.25 14,21.25 10.25,26 7,22.5 7,21 13,22 19,22.25 25,23.25 25,21.75 8.75,22.5 8.75,21 10,23 11.25,22 10,20.75 11,23 11,21 20.75,22.25 22,21.25 23.25,21.75 23.25,23.25 22,23.5 21,23.25 21,21.25 19,20.5 20.25,24 23.75,24 11.75,23.75 11.75,20.25 19.75,20 14.25,33.75 14.25,31.25 11,33 11,32 5,22.25 7,23.75 7,25.25 12.75,20 13,23.75 11.75,25 15.5,25.5 20.25,25.25 18.75,24.25 10,19 11.5,19 12.5,18 10,17.75 12.5,16.5 15.5,18 15.5,16.5 18.25,16.5 19.75,16.5 21,16.5 22,18.25 19,18.12 11,16.75 22.5,35.75 22.5,32.25 23.25,25.75 21.75,29.75 9,19 8,20 24.5,7.75 24.5,10.25 14.75,19 10.5,44 12.5,44 5.62,42.5 4.38,42.5 4.38,41.5 11.75,41 10.25,41 39,17 39,13 43,14.5 43,15.75 41.5,17 40.25,17 38,18 38.5,20.25 35.75,17.5 34,17.5 34.5,15.5 40.5,22 38.5,21.5 40.5,24 38.5,24 37,20.75 35.75,19.5 37,19.25 35.75,21.75 34,19 42,25.25 42,24 44,24 38.5,30 40.5,31.5 42,30.5 42.25,32.25 42,35 43.5,38 45.25,36.25 48,34.5 48.75,33 50.25,32 50.25,28 44.25,28 45.5,30 44.75,26.25 47.75,26 49,26.75 47.75,24.25 43,26.25 43.5,19.75 47.25,19.5 45.5,18.5 49.5,13.25 47.5,14.5 46.75,9.75 45.75,8.5 43,5.5 39.25,6.5 39,8.75 38.75,9.75 36,11.25 34,11.25 34.75,10.25 36,9 32.75,15.5 32.5,17.5 48.5,12 44,11 45.5,11 37.75,6.5 36.75,7.75 41,5.25 29.5,14.75 29.5,17.5 28.5,17 27.25,15.25 27,12.5 29.5,12.25 29.5,11 27,11 26,10.25 26.25,7.75 28,8.25 29.25,9.5 36,35.75 36,32.25 37.25,32.5 37.25,35.5 38.5,31.5 16.5,11 16.5,7 12,9 6.75,15 13.5,11 12,11 8,12.25 10,12.25 8.5,8.25 26.75,23.5 26.25,22.25 8,31.5 6,29.25 8,35 6,34.75 8.75,38 9.5,40.25 11,40.25 7.5,43 7.5,46.25 9.5,44.5 48.5,6.75 53.5,9.25 51.5,10 51.5,11.25 53.25,11.25 52,17.5 52,19.25 52,15.75 52,14.75 50,14.75 52,13.75 50.25,20.12 51,21.25 52.5,21.25 54,20 54.25,17.5 54.25,15.75 54.25,14 54.25,12.25 49.5,11 47.25,12 49,4.25 51,4.25 39,74.5 9.5,53 1,46.75 1,45 1,43 1,39 1,41 1,22 1,20 1,8 1,6 5,6 6,4.75 6,1 8,1 10,1 12.25,1 18,4.5 20,4.5 22,4.5 24,4.5 26,4.5 28,4.5 30,4.5 32,4.5 34,4.5 36,4.5 38,4.5 40,4.5 42,4.5 44,4.5 45.75,2.5 45.75,1 50.25,1 52,1 54,1 54,5 55.5,6 57.25,6.5 59,8 59,10 59,12 59,14 59,16 59,18 59,19.75 59,22.25 59,24 59,26 59,28 59,30 59,32 59,34 59,36 59,49 59,51 59,53 59,55 59,57 59,59 59,61 59,63 59,64.75 59,67 59,69.25 59,70.5 59,74 59,72 55,74 53.75,75.75 52,79 50,79 48,79 46,79 44,79 42,79 40,79 38,79 36,79 34,79 32,79 30,79 28,79 26,79 24,79 22,79 20,79 18,79 16,79 14,79 12,79 10,79 8,79 6,79 59,40 8.75,26.75 10,28 20,36.5 26.25,44.75 27.75,43.5 29.25,40.75 33.25,39.75 31.25,30.5 32.5,31 26.25,29.75 30.5,29.75 50.25,8.75 49.5,7 47.25,7 35,12.25 32.75,12.25 31,15.5 31,17.5 32.75,14 43,8.5 45.5,14.5 46.5,18.5 47.75,20.5 49.75,21.5 47.75,22.75 49.5,22.75 18.75,64.25 17.25,58.75 22.5,58.75 28,58.75 28,60.25 31,58.75 33,58.75 34.25,58.75 25,36.25 24.5,31.5 34.5,20.5 3,21 5,20 7,18 9,16 11,14 13,14 15,14 17,14 19,14 21,14 23,14 25,16 27,18 29,20 31,22 33,24 35,26 40.25,42.5 37.25,42.5 42,39.25 20,58.75 17,60.25 23,60.25 34,60.25 12.5,69 15.5,73.75 17.5,73.75 17.75,71.5 28.75,71.5 22.25,71.5 33.25,71.5 22.25,73.25 28.75,73.25 26.75,71.5 24.25,71.5 38.5,59.75 35.75,56 20,56.75 31,56.75 13.25,58.25 14.5,57 55,7.25 53.5,35 53.5,33 54,60.25 41,51.75 53.25,50.75 47.5,48 49.5,48 49.5,46 49.75,44.25 50.75,41.75 50.75,43.25 9.5,45.75 7.5,44.5 25.75,19.25 21.5,26.25 1,60 1,62 1,64 1,66 1,68 1,70 1,72 1,74 5,74 6.25,75.25 47.5,50.75 49,52 54.25,28.25 54,32 58,26.75 56.75,24.5 54,22.5 49.75,36.25 53,24.5 51.5,26.5 11.25,67.75 42.5,17 45.5,20.25 50,25 52,23 46.5,35 45.75,4.25 48,1 48,3 18.5,43.75 36,6.5 35,7.75 41,7.75 43,7.5 44.25,8.5 44.5,6 49.5,16 19.5,42.75 49.75,42.5 4.5,12.25 4.5,15.75 4.5,30.75 4.5,34.25 4.5,52.25 4.5,55.75 9.25,21.75 22.75,22.5 10.25,21.75 21.75,22.5 18.75,32 14.5,41.75 12.25,43 9.75,36 1,57.5 3,57.5 4,57.5 1,50.5 3,50.5 4,50.5 1,36 3,36 4,36 1,29 2,29 4,29 3,30 3,29 2,35 2,36 2,51.5 2,50.5 2,57.5 2,56.5 3.5,38.25 2.5,40.25 3.5,43.5 14.75,21.75 18,22 13,19 15.5,27 12.75,25 5,23.5 5.75,26.75 5.75,21.25 9.5,13.5 10,9.75 8,10.75 10.75,7 21.5,7.75 21.5,10.25 21.5,32.75 20.5,35.25 20.75,31.5 23.25,28.25 19.25,30 20.75,28.25 22.5,26.5 24.75,24.25 29,24 15,33 15,32 15,30.5 15,34.5 15,35.75 37,23 38.5,28.5 40.5,28.5 38.25,35.25 45.75,12 47.25,10.75 1,17.5 2,17.5 3,17.5 3,16.5 2,11.5 2,10.5 1,10.5 3,10.5 4,10.5 4,17.5 5.75,11.75 5.75,16.25 5.5,51.5 8,32.75 5.62,41.5 4.25,46.5 5.75,46.5 5,43.25 6.5,43.5 10,34.5 9.5,33 9.5,31.25 48,18.5 48,15.25 46.75,15.25 46.5,17.5 49.5,19 47.75,5.5 46.5,67.5 46,70 46,72 50,73.5 53,69 51.25,69 52.75,71.25 32,9 30,7 29.5,13.5 27,14 27.75,16.25 14.75,53 6.25,55 5,58
  pour Top (isolate 0.254): 0,80 60,80 60,0 0,0
  pour Bottom (isolate 0.254): 0,80 60,80 60,0 0,0
  cutout Top (isolate 0.203): 26.25,36.75 26.25,35.5 25.25,35.5 25.25,32.5 26.5,32.5 26.5,31.25 29.5,31.25 29.5,32.5 30.75,32.5 30.75,35.5 29.5,35.5 29.5,36.75
  pour Top (isolate 0.254, no thermals): 2.75,47.25 2.75,41.5 7.25,41.5 7.25,47.25
  pour Top (isolate 0.254, no thermals): 11,34.25 11,31 15,31 15,34.25
  pour Top (isolate 0.254, no thermals): 5,40.75 5,37.5 7,37.5 7,40.75
  pour Top (isolate 0.254, no thermals): 8,37 8,27 0,27 0,37
  pour Top (isolate 0.254, no thermals): 5,18.5 5,9.5 0,9.5 0,18.5
  cutout Top (isolate 0.254, no thermals): 16.25,54.5 16.25,52.5 19.25,52.5 19.25,54.5
  cutout Top (isolate 0.254, no thermals): 20.75,54.5 20.75,52.5 23.75,52.5 23.75,54.5
  cutout Top (isolate 0.254, no thermals): 27.25,54.5 27.25,52.5 30.25,52.5 30.25,54.5
  cutout Top (isolate 0.254, no thermals): 31.75,54.5 31.75,52.5 34.75,52.5 34.75,54.5
  cutout Top (isolate 0.254, no thermals): 16,48.5 18,48.5 18,51.5 16,51.5
  cutout Top (isolate 0.254, no thermals): 22,48.5 24,48.5 24,51.5 22,51.5
  cutout Top (isolate 0.254, no thermals): 27,48.5 29,48.5 29,51.5 27,51.5
  cutout Top (isolate 0.254, no thermals): 33,48.5 35,48.5 35,51.5 33,51.5
  cutout Route2 (isolate 0.254, no thermals): 0,15.75 0,12.25 3.5,12.25 5.25,14 3.5,15.75
  cutout Route15 (isolate 0.254, no thermals): 0,15.75 0,12.25 3.5,12.25 5.25,14 3.5,15.75
  cutout Route15 (isolate 0.254, no thermals): 0,34.25 0,30.75 3.5,30.75 5.25,32.5 3.5,34.25
  cutout Route2 (isolate 0.254, no thermals): 0,34.25 0,30.75 3.5,30.75 5.25,32.5 3.5,34.25
  pour Route2 (isolate 0.254, no thermals): 0,80 60,80 60,0 0,0
  pour Route15 (isolate 0.254, no thermals): 0,80 60,80 60,0 0,0
  pour Bottom (isolate 0.254, no thermals): 26,36 26,32 30,32 30,36
  pour Top (isolate 0.254, no thermals): 12,40.5 12,37.25 14,37.25 14,40.5
  pour Top (isolate 0.254, no thermals): 19,35.5 19,32.5 21.5,32.5 21.5,35.5
  pour Top (isolate 0.254, no thermals): 7.25,58 7.25,50 0,50 0,58
  cutout Route2 (isolate 0.254, no thermals): 0,55.75 0,52.25 3.5,52.25 5.25,54 3.5,55.75
  cutout Route15 (isolate 0.254, no thermals): 0,55.75 0,52.25 3.5,52.25 5.25,54 3.5,55.75
  pour Bottom (isolate 0.254, no thermals): 5,18.5 5,9.5 0,9.5 0,18.5
  pour Bottom (isolate 0.254, no thermals): 5,37 5,28 0,28 0,37
  pour Bottom (isolate 0.254, no thermals): 5,58.5 5,49.5 0,49.5 0,58.5
  cutout Top: 12.75,3.75 12.75,0 45.25,0 45.25,3.75
  pour Top (isolate 0.254, no thermals): 11,6.25 19,6.25 19,11 11,11
  pour Top (isolate 0.254, no thermals): 25.5,28 25.5,15 6,15 6,28
  cutout Top: 17.5,66 16,66 16,69.25 17.5,69.25
  cutout Top: 23,64.75 21.5,64.75 21.5,69.25 23,69.25
  cutout Top: 29.5,66 28,66 28,69.25 29.5,69.25
  cutout Top: 35,64.75 33.5,64.75 33.5,69.25 35,69.25
  pour Top (isolate 0.254, no thermals): 36.75,17.5 36.75,12.25 38.25,12.25 38.25,10.75 43.75,10.75 43.75,12.25 45.25,12.25 45.25,17.5 43.5,17.5 43.5,19.25 38.5,19.25 38.5,17.5
  cutout Top (isolate 0.254, no thermals): 48,40.5 49,40.5 49,41 48,41
  cutout Route2: 50.12,17.12 50.12,16.12 51.62,16.12 51.62,17.12
MIX_ADJ
  Top 0.203: IC7.19 25.75,35.25 25.75,36.5 24.9,37.35 R22.2 24.9,37.6 23.1,39.4 R21.1
MIX_IN  (via drill 0.35)
  Top 0.254: IC7.4 28.25,30.38 v28.5,30.12
  Top 0.584: v31.5,45 R12.1
  Bottom 0.584: v31.5,45 31.38,44.88 31.38,41.75 32.25,40.88 32.25,32.25 31.38,31.38 28.88,31.38 28.38,30.88 28.38,30.25 v28.5,30.12
MIX_IP  (via drill 0.35)
  Top 0.254: IC7.3 27.75,30.38 v27.5,30.12
  Top 0.584: v30.5,45 R11.1
  Bottom 0.584: v27.5,30.12 27.62,30.25 27.62,31.25 28.5,32.12 31,32.12 31.5,32.62 31.5,40.5 30.62,41.38 30.62,44.88 v30.5,45
MIX_QN  (via drill 0.35)
  Top 0.254: IC7.15 28.25,37.25 v28.5,37.5
  Top 0.584: R14.1 v20.5,45
  Bottom 0.584: v20.5,45 20.38,44.88 20.38,44.25 21,43.62 26.25,43.62 28.38,41.5 28.38,37.62 v28.5,37.5
MIX_QP  (via drill 0.35)
  Top 0.254: IC7.16 27.75,37.25 v27.5,37.5
  Top 0.584: v19.5,45 R13.1
  Bottom 0.584: v27.5,37.5 27.62,37.62 27.62,41.12 25.88,42.88 20.62,42.88 19.62,43.88 19.62,44.88 v19.5,45
N$1
  Top 0.305: IC2.4 C14.1 | C14.1 arc45 C14.1
N$2
  Top 0.203: R5.2 45,24.9 C10.2
N$3
  Top 0.254: C39.1 29.85,51 L4.2 27.75,51.25 L8.1
N$4
  Top 0.279: T1.4 21.68,34.41 arc45 C35.2
N$5
  Top 0.254: IC3.33 39.75,10.75 39.5,10.5 37.9,10.5 C13.1
N$6
  Top 0.254: C39.2 32.15,51 L5.2 34.25,51.25 L9.1
N$7
  Top 0.254: L6.1 17.5,49 C38.1 18.95,49.15 19,49.1 19,47.75 18.4,47.15 C31.2
N$8
  Top 0.254: C33.1 arc-45 24.71,33.75 IC7.22
N$9
  Top 0.254: L7.1 C38.2 21,48.9 21,47.75 21.6,47.15 C32.2
N$10
  Top 0.254: C40.1 18.85,51 L6.2 16.75,51.25 L10.1
N$11
  Top 0.254: C40.2 21.15,51 L7.2 23.25,51.25 L11.1
N$12
  Top 0.254: IC3.29 35,13.25 34.1,14.15 C16.1
N$13
  Top 0.508: IC17.4 52.65,10.25 54.4,10.25 C82.1
N$14
  Top 0.305: L2.2 L3.1
N$15
  Bottom 0.203: R41.1 57.15,25.85 55.35,27.65 R42.2 55.25,27.85 55.25,29.5 IC15.1
N$16  (via drill 0.35)
  Top 0.203: R43.1 55.65,30.9 v56.5,31.75
  Bottom 0.203: IC15.2 55.6,31.75 v56.5,31.75
N$17
  Top 0.305: C34.1 R15.1
N$18
  Top 0.305: C36.1 R20.1
N$19
  Top 0.203: IC18.10 40,60 38,58 38,40 45,33 45,31.25 44.65,30.9 R47.1
N$20
  Top 0.254: C35.1 arc45 24.71,34.25 IC7.21
N$21
  Top 0.203: C3.2 49,16.75 50.75,16.75 X1.3
N$22
  Top 0.508: IC16.4 11.05,59.65 11,59.6 11,58.4 C81.1
N$23
  Top 0.305: L1.2 R2.2
N$24
  Top 0.203: IC18.11 39.95,59.2 38.5,57.75 38.5,40.25 45.5,33.25 45.5,31.75 46.35,30.9 R48.1
N$25
  Top 0.203: IC18.12 39.9,58.4 39,57.5 39,40.5 46,33.5 46,32.25 46.5,31.75 47.5,31.75 48.35,30.9 R49.1
N$26
  Top 0.305: R6.2 C22.2
N$27
  Top 0.203: IC18.13 39.85,57.6 39.5,57.25 39.5,40.75 46.5,33.75 46.5,32.75 47,32.25 49,32.25 50.35,30.9 R50.1
N$28
  Top 0.203: R46.2 39.1,61.1 40,62 40,64 39.1,64.9 D3.A
N$29  (via drill 0.35)
  Top 0.203: CON5.B5:CC2 v54.25,44.75 | v55.5,34 R52.2
  Bottom 0.203: v54.25,44.75 54.75,44.75 56.25,43.25 56.25,34.75 v55.5,34
N$30  (via drill 0.35)
  Top 0.203: CON5.A5:CC1 v54.25,41.75 | v55.5,36 R51.2
  Bottom 0.203: v54.25,41.75 55.25,41.75 55.75,41.25 55.75,36.25 v55.5,36
N$32
  Top 0.254: L4.1 C37.1 30,48.9 30,47.75 29.4,47.15 C29.2
N$33
  Top 0.254: L5.1 32,49 | 32,49 C37.2 | 32,49 32,47.75 32.6,47.15 C30.2
N$34
  Top 0.254: R15.2 arc45 31.29,33.75 IC7.9
N$35
  Top 0.254: R20.2 arc-45 31.29,34.25 IC7.10
N$36
  Top 0.203: D1.K R43.2
N$37
  Top 0.203: D2.K R44.2
N$38
  Top 0.305: FIL1.4 13,30.25 arc-90 11.75,29 10.5,29 arc45 8.79,28.29 6.5,26 arc45 6,24.79 6,22.75 arc90 7,21.75 IC1.22
N$39
  Top 0.305: IC2.2 C15.1
N$40
  Top 0.305: IC5.4 C15.2
N$41
  Top 0.305: IC5.6 C26.1
N$42
  Top 0.305: C5.2 arc-45 6,37.66 IC2.6
N$43
  Top 0.305: C14.2 | C14.2 arc45 C14.2 | C14.2 IC4.1
N$44
  Top 0.305: IC4.3 6.5,42 L3.2 C18.1
N$45
  Top 0.305: IC1.5 10.75,18.75 arc90 12.25,17.25 FIL5.1
N$46
  Top 0.305: IC1.14 10.75,24.75 arc-90 12.25,26.25 FIL4.1
N$47
  Top 0.305: IC1.11 12.9,22.75 arc45 14.1,23.25 FIL2.1
N$48
  Top 0.305: FIL8.1 FIL4.3
N$49
  Top 0.305: IC6.8 19.1,23 arc-45 18.15,23.39 FIL6.3
N$50
  Top 0.305: FIL5.3 16.15,17.25 arc-90 FIL9.6
N$51
  Top 0.305: FIL3.2 FIL7.1
N$52
  Top 0.305: IC6.11 19.1,21.5 arc45 18.5,21.25 18.43,21.18 arc45 FIL7.3
N$53
  Top 0.305: FIL9.4 arc-90 17.35,17.25 19.75,17.25 arc90 21.25,18.75 IC6.14
N$54
  Top 0.305: IC6.5 21.25,24.75 arc90 19.75,26.25 FIL8.3
N$55
  Top 0.203: IC3.9 46.75,16.75 C4.1
N$56
  Top 0.279: T1.3 21.68,33.59 arc-45 C33.2
N$57
  Top 0.305: IC5.2 14.25,39.25 14.25,40.25 arc90 12.5,42 C18.2
N$58
  Top 0.254: C29.1 R11.2
N$59
  Top 0.254: R12.2 C30.1
N$60
  Top 0.254: R13.2 C31.1
N$61
  Top 0.254: C32.1 R14.2
N$62
  Top 0.254: R7.2 26.75,61.5 | 26.75,61.5 R16.1 | 26.75,61.5 27,61.5 27.48,61.02 IC8.8
N$63
  Top 0.254: R8.2 R17.1 35.1,61.6 34.52,61.02 IC8.1
N$64
  Top 0.254: 26.85,63.4 R16.2 | 26.85,63.4 27.27,62.98 IC8.5 | IC12.3 28.11,66.36 27.5,65.75 27.5,64 26.9,63.4 26.85,63.4
N$65  (via drill 0.35)
  Top 0.254: IC13.2 15.13,67.64 14.6,67.1 R33.2 v14.5,66.25
  Bottom 0.254: v14.5,66.25 14.5,67.4 R29.2
N$66
  Top 0.254: R18.1 15.75,61.75 | 15.75,61.75 R9.2 | 15.75,61.75 16.48,61.02 IC9.8
N$67
  Top 0.254: R10.2 R19.1 24.1,61.6 23.52,61.02 IC9.1
N$68  (via drill 0.35)
  Top 0.254: IC12.6 36.23,66.36 R32.2 v36.5,65.25
  Bottom 0.254: v36.5,65.25 36.5,67.4 R28.2
N$69
  Top 0.254: IC13.3 16.11,66.36 15.5,65.75 15.5,63.65 R18.2 15.85,63.4 16.27,62.98 IC9.5
N$70
  Top 0.254: 48.4,49 C76.1
  Top 0.508: IC14.4 46.7,49 48.4,49 C76.1
N$71
  Top 0.203: IC18.2 49,69 49.85,69.85 X2.3 50.15,69.75 51.98,69.75 C75.1
N$72
  Top 0.203: IC18.3 48.2,68.15 X2.1 47.6,68.15 46.75,69 46.75,71 47,71.25 47.6,71.25 C78.1
N$73
  Top 0.305: FIL2.3 FIL6.1
N$74  (via drill 0.35)
  Top 0.254: IC12.2 27.04,67.64 R31.2 v26.5,66.25
  Bottom 0.254: v26.5,66.25 26.5,67.4 R27.2
N$75
  Top 0.254: IC12.5 34.66,65.09 35.25,64.5 R17.2 35.15,63.4 34.73,62.98 IC8.4
N$76
  Top 0.254: R31.1 IC12.1 28.25,68.91 28.25,70.1 R35.1
N$77
  Top 0.254: IC13.5 22.39,65 23.75,65 24.25,64.5 R19.2 24.15,63.4 23.73,62.98 IC9.4
N$78
  Top 0.254: IC13.7 24.23,67.64 R34.1 24.5,69.5 23.4,70.6 R38.1
N$79
  Top 0.254: IC12.7 36.23,67.64 R32.1 36.5,69 35.25,70.25 34.6,70.25 R36.1
N$80  (via drill 0.35)
  Top 0.254: IC13.6 24.23,66.36 R34.2 v24.5,65.25
  Bottom 0.254: v24.5,65.25 24.5,67.4 R30.2
N$81
  Top 0.254: R33.1 IC13.1 16.75,68.95 R37.1
N$83
  Bottom 0.254: R28.1 34.5,67.5 R25.1 32.15,67.4 31.25,66.5 IC10.2
N$84
  Bottom 0.254: R27.1 30.25,67.5 | 30.25,67.5 R25.2 | IC10.1 30.3,67.45 30.25,67.5
N$85
  Bottom 0.254: R30.1 22.5,67.5 R26.1 20.15,67.4 19.25,66.5 IC11.2
N$86
  Bottom 0.254: R29.1 R26.2 18.3,67.45 IC11.1
N$87
  Top 0.305: IC1.8 12.4,21.25 arc-45 13,21 13.18,20.82 arc45 13.96,20.5 FIL3.5
N$88
  Top 0.203: IC3.8 C3.1
N$89
  Top 0.254: IC3.36 41.25,10 41.85,9.4 C12.1
N$90
  Top 0.254: IC3.38 42.25,11 42.5,10.75 43,10.75 43.85,9.9 C11.1
N$91
  Top 0.254: IC3.3 46.25,13.75 46.6,13.4 C6.1
N$92
  Top 0.254: IC3.10 44.5,17.25 44.75,17.5 44.75,19.35 C8.1
N$93
  Top 0.254: IC3.27 36.75,14.25 36.1,14.25 C17.1
PGA_SW  (via drill 0.35)
  Top 0.203: IC18.9 41.1,60.8 R46.1 40.9,61.15 41.5,61.75 v42,61.75
  Route15 0.203: v20.25,64 21,63.25 30.25,63.25 31,64 v32.25,64 33,63.25 37.5,63.25 39,61.75 v42,61.75
  Bottom 0.203: IC11.4 20.2,63.95 v20.25,64 | v32.25,64 32.2,63.95 IC10.4
PLL_EN  (via drill 0.35)
  Top 0.203: IC3.1 44.7,12.75 44.75,12.7 v44.75,12
  Bottom 0.203: R3.1 44.65,12.1 v44.75,12
PLL_ICP
  Top 0.203: IC3.12 42.75,21.1 C9.1 43.1,21.25 44.9,21.25 C10.1 45.1,21.25 46.6,21.25 R4.2
PLL_OUT
  Top 0.305: CON3.SIG 7,14 arc-90 9,12 9,10 arc90 11,8 C21.2
PLL_OUT1N
  Top 0.229: C22.1 17.57,9.43 arc45 18,9.25 26.5,9.25 arc90 28,10.75 28,14.25 arc-90 30.5,16.75 IC3.22
PLL_OUT1P
  Top 0.229: C21.1 17.57,8.57 arc-45 18,8.75 26.5,8.75 arc90 28.5,10.75 28.5,14.25 arc-90 30.5,16.25 IC3.23
PLL_OUT2N
  Top 0.229: C36.2 36.54,34.75 arc45 37.75,34.25 38,34.25 arc-90 39.75,32.5 IC3.18
PLL_OUT2P
  Top 0.229: C34.2 36.54,33.25 arc-45 37.75,33.75 38,33.75 arc-90 39.25,32.5 IC3.19
PLL_SPI_CS  (via drill 0.35)
  Top 0.203: v35.5,15.5 35.75,15.75 IC3.24 | v45.25,27.5 46,26.75 47,26.75 48,26.75 49.5,28.25 50.35,29.1 R50.2
  Bottom 0.203: v35.5,15.5 35,16 35,19.75 38.5,23.25 45.25,23.25 45.5,23.5 45.5,27.25 v45.25,27.5
PLL_SPI_MISO  (via drill 0.35)
  Top 0.203: IC3.20 38.75,18.75 v38.25,19.25 | v46.5,28.25 46.5,29 | 46.5,29 R48.2 | D2.A 53.15,25.6 52.25,26.5 52.25,29.25 51.5,30 47.5,30 46.5,29
  Bottom 0.203: v38.25,19.25 37.75,19.75 37.75,21.75 38.75,22.75 45.5,22.75 46,23.25 46,27.75 v46.5,28.25
PLL_SPI_MOSI  (via drill 0.35)
  Top 0.203: IC3.17 40.25,20.5 v41,21.25 | v48.5,28.25 R49.2
  Bottom 0.203: v41,21.25 41.25,21.5 41.25,21.75 41.75,22.25 45.75,22.25 46.5,23 46.5,27.25 47.5,28.25 v48.5,28.25
PLL_SPI_SCK  (via drill 0.35)
  Top 0.203: IC3.16 40.75,20 v41,20.25 | v47.75,27.5 46.25,27.5 44.65,29.1 R47.2
  Bottom 0.203: v41,20.25 41.75,21 41.75,21.5 42,21.75 46,21.75 47,22.75 47,26.75 v47.75,27.5
PLL_VCTRL  (via drill 0.35)
  Top 0.203: R4.1 48.65,21.35 49,21 v49,20.5
  Top 0.254: IC3.35 40.75,10.25 40.15,9.65 C7.1 40.1,9.65 v40.75,9
  Bottom 0.203: v49,20.5 48.75,20.25 48.75,18.25 48.75,14.5 46.5,12.25 46.5,10.75 45,9.25 42.5,9.25 42.25,9 v40.75,9
RF_IN
  Top 0.305: CON2.SIG L1.1 C5.1
RFIN_SW1  (via drill 0.35)
  Top 0.203: IC2.5 5,38.75 4.75,38.5 v4.75,38 | IC18.29 53.65,58.4 v53.75,58.5
  Route15 0.203: v4.75,38 4.75,37.25 5.25,36.75 15,36.75 16.5,38.25 16.5,41.5 15.5,42.5 15.5,48.5 19,52 34,52 38.75,56.75 38.75,57.75 39.75,58.75 53.5,58.75 v53.75,58.5
RFIN_SW2  (via drill 0.35)
  Top 0.203: IC5.5 12,38.75 11.75,38.5 v11.75,38 | IC18.30 52.95,59.2 v53.25,59.5
  Route15 0.203: v11.75,38 12.5,37.25 14.75,37.25 16,38.5 16,41.25 15,42.25 15,48.75 18.75,52.5 33.75,52.5 38.25,57 38.25,58 39.5,59.25 53,59.25 v53.25,59.5
ST_BOOT0
  Top 0.203: IC18.31 52.75,60 54.25,61.5 54.25,65.5 54.25,65.75 | 54.25,65.75 SW1.3 54.33,66 58.67,66 SW1.4 | 54.25,65.75 54.25,66 54,66 52,66 51.9,66.1 R45.2
ST_NRST  (via drill 0.35)
  Top 0.203: IC18.4 47.4,63.48 v47.38,63.5 | v42.5,62.75 41.15,62.75 C79.1
  Bottom 0.203: v47.38,63.5 43.25,63.5 v42.5,62.75
SWCLK
  Top 0.203: IC18.24 49.8,53.45 50.25,53 53.17,53 55.25,50.92 CON4.1
SWDIO
  Top 0.203: IC18.23 49,53 49.5,52.5 52.75,52.5 55.5,49.75 56.5,49.75 57.25,50.5 57.25,57.29 CON4.4
UART_RX
  Top 0.203: IC18.25 54.26,55.2 CON4.2
UART_TX
  Top 0.203: IC18.26 53.5,56 54.5,57 54.5,59.58 CON4.5
USB_DM
  Top 0.203: IC18.21 47.4,51.85 48.5,50.75 49.5,50.75 50.25,50 50.25,44.75 51.75,43.25 | 51.75,43.25 CON5.A7:DN1 | CON5.B7:DN2 52,42.25 51.75,42.5 51.75,43.25
USB_DP
  Top 0.203: IC18.22 48.2,51.8 48.75,51.25 49.75,51.25 50.75,50.25 50.75,45 52,43.75 CON5.B6:DP2 53.88,43.75 54.12,43.5 54.12,43 53.88,42.75 CON5.A6:DP1
USB_VBUS  (via drill 0.35)
  Top 0.508: CON5.B4,A9:VBUS 51.85,45.4 v51.75,45.4 | CON5.A4,B9:VBUS 51.85,40.6 v51.75,40.6 49.75,40.6 FB6.1
  Bottom 0.61: v51.75,45.4 v51.75,40.6
VCC_HFAMP
  Top 0.61: C49.1 C44.1 | FB3.2 10.5,48.5 C44.1 | L2.1 8.5,47.25 | 8.5,47.25 C54.1 | C44.1 10.4,46.75 | C44.1 10.4,46.75 | 10.4,46.75 9.75,46.75 9.25,47.25 8.5,47.25
VCC_MIX  (via drill 0.35)
  Top 0.254: IC7.24 25.5,32.75 25.25,32.5 C64.1 | IC7.13 29.25,36.5 29.88,37.12 C66.1 | IC7.6 29.25,30.75 C59.1
  Top 0.406: C66.1 30.1,37.35 C53.1
  Top 0.508: C53.1 30.1,40.75 | 30.1,40.75 30.1,41.9 C43.1 | 30.1,40.75 33.1,40.75 33.85,41.5 FB2.2 | C64.1 25.25,28.6 C57.1 25.25,28.4 v25.25,27.5 | C59.1 29.5,28.6 C48.1 29.5,28.4 v29.5,27.5
  Top 0.61: R21.2 v26,39.5 C53.1
  Bottom 0.61: v26,39.5 23.5,37 23.5,31.25 25.25,29.5 v25.25,27.5 v29.5,27.5
VCC_OSC
  Top 0.508: C2.1 53,20.02 53,18.5 X1.1 53,18.2 53,16.8 X1.4 53,16.5 C1.1 53,12.6 FB1.2
VCC_PLL  (via drill 0.35)
  Top 0.254: v45.5,15.5 45.25,15.75 IC3.7 | v41.5,19.5 41.25,19.25 IC3.15 | IC3.37 41.75,10.62 v41.88,10.5 | IC3.26 36.88,14.75 v36.5,15.12 | IC3.21 37.3,17.25 37,17.55 v37,18 | IC3.11 43.25,18.45 43.3,18.5 v43.75,18.5
  Top 0.508: C85.1 50.5,10 IC17.5 50.55,11.8 51,12.25 51,12.4 FB1.1 | v49,9.25 49,9.5 C85.1 | C85.1 48,9.5 v48,9.25
  Bottom 0.508: v41.5,19.5 C28.1 41.85,19.15 43.5,17.5 C20.1 | v45.5,15.5 45.25,15.75 C27.1 | v36.5,15.12 36.5,14.75 36.85,14.4 C24.1 | v37,18 37,17.4 C25.1 36.85,17.15 37.5,16.5 37.5,14.75 37,14.25 C24.1 | v41.88,10.5 41.35,10.5 C23.1 | C24.1 36.85,13.9 37.25,13.5 37.25,11.75 38,11 38.5,11 | C23.1 41.1,10.85 42.25,12 42.75,12 43.25,12.5 43.25,12.9 R3.2 44.25,14.85 C27.1 | C27.1 45.15,15.85 | C23.1 40.85,11 39.15,11 C19.1 38.85,11 38.5,11 | 38.25,10.75 38.5,11 | C27.1 45.15,15.85 | C20.1 43.6,17.4 45.15,15.85 | C20.1 43.75,17.65 v43.75,18.5 | C87.1 38.02,7.88 38.12,7.88
  Bottom 0.813: v49,9.25 v48,9.25 46.12,7.38 44.38,7.38 43.5,6.5 40.75,6.5 39.5,7.75 C87.1 | 38.25,10.75 37.75,10.25 37.75,8.25 38.12,7.88 38.02,7.88
VCC_RFSW1  (via drill 0.35)
  Top 0.254: IC2.1 7,38.75 7.25,38.5 v7.25,38 | IC5.1 14,38.75 14.25,38.5 v14.25,38
  Bottom 0.61: v7.25,38 C50.1 C55.1 | C55.1 v14.25,38 | C55.1 C45.1 18.1,39.1 FB4.2
VCC_RFSW2  (via drill 0.35)
  Top 0.254: IC1.16 9.75,25 v9.5,25.25 | IC6.16 22.25,19.25 v22.5,19
  Bottom 0.508: C56.1 22.35,19.75 21.25,19.75 19.75,21.25 19.75,23.25 19.5,23.5 19.5,24.75 18.75,25.5 18.75,26.1 C46.1 | C58.1 9.6,24.75 10.25,24.75 11.75,26.25 12.75,26.25 C51.1 12.75,26.23 12.72,26.25 16,26.25 16.5,26.75 16.5,28.25 16.85,28.6 FB5.2
  Bottom 0.61: C46.1 18.6,27.25 17.35,28.5 17.1,28.5 FB5.2 | C56.1 v22.5,19 | C58.1 v9.5,25.25
VCOM  (via drill 0.35)
  Top 0.254: v20.75,61.5 20.93,61.67 IC9.2 | v31.75,61.5 31.93,61.67 IC8.2
  Top 0.508: R39.1 v10.25,63.75 R40.2
  Route15 0.61: v10.25,63.75 12.5,61.5 18,61.5 18.75,60.75 20,60.75 v20.75,61.5 29,61.5 29.75,60.75 31,60.75 v31.75,61.5
  Bottom 0.305: C65.1 20.75,60.15 v20.75,61.5 | C69.1 31.75,60.15 v31.75,61.5

## Text on the board
Top: Spectrum Analyzer 7GHz
tPlace: ver2
tStop: Spectrum Analyzer 7GHz